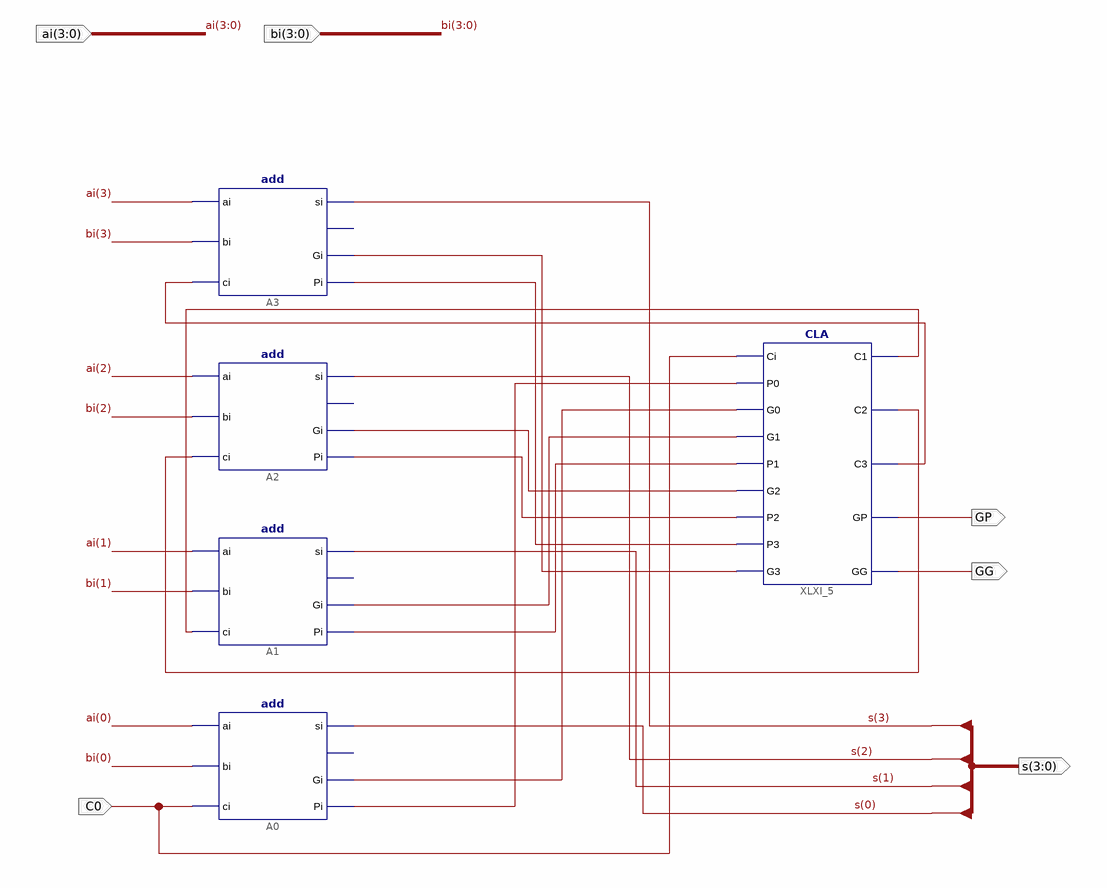
[diagram p0: schematic sheet 1]
// Xilinx ISE schematic add4b.sch (kintex7) as structural Verilog: 5 symbols, 6 ports
module add4b (
  input  [3:0] ai,
  input  [3:0] bi,
  input  C0,
  output GP,
  output GG,
  output [3:0] s
);

  wire XLXN_14, XLXN_15, XLXN_16, XLXN_17, XLXN_18, XLXN_19, XLXN_20, XLXN_21, XLXN_22, XLXN_23, XLXN_24;

  add A0 (.ai(ai[0]), .bi(bi[0]), .ci(C0), .si(s[0]), .Gi(XLXN_20), .Pi(XLXN_21));  // open: CO
  add A1 (.ai(ai[1]), .bi(bi[1]), .ci(XLXN_24), .si(s[1]), .Gi(XLXN_18), .Pi(XLXN_19));  // open: CO
  add A2 (.ai(ai[2]), .bi(bi[2]), .ci(XLXN_23), .si(s[2]), .Gi(XLXN_16), .Pi(XLXN_17));  // open: CO
  add A3 (.ai(ai[3]), .bi(bi[3]), .ci(XLXN_22), .si(s[3]), .Gi(XLXN_14), .Pi(XLXN_15));  // open: CO
  CLA XLXI_5 (
    .Ci(C0), .P0(XLXN_21), .G0(XLXN_20), .G1(XLXN_18), .P1(XLXN_19), .G2(XLXN_16), .P2(XLXN_17),
    .P3(XLXN_15), .G3(XLXN_14), .C1(XLXN_24), .C2(XLXN_23), .C3(XLXN_22), .GP(GP), .GG(GG));
endmodule
